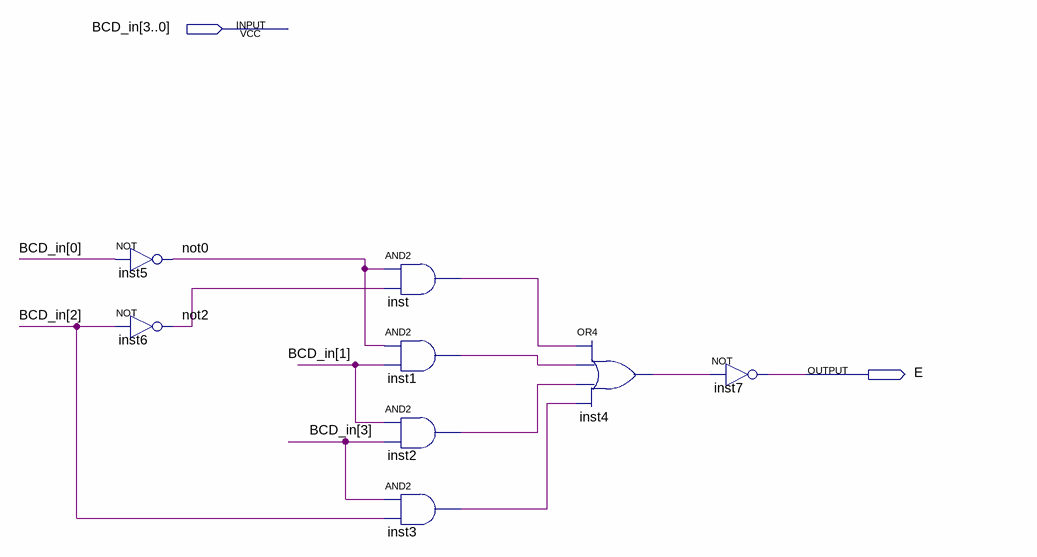
[diagram p0: schematic sheet]
// Quartus schematic E.bdf as structural Verilog: 8 symbols, 2 pins
module E (
  input  [3:0] BCD_in,
  output E
);

  wire inst1_out, inst2_out, inst3_out, inst4_out, inst_out, not0, not2;

  not inst5 (not0, BCD_in[0]);
  not inst6 (not2, BCD_in[2]);
  and inst (inst_out, not0, not2);
  and inst1 (inst1_out, not0, BCD_in[1]);
  and inst2 (inst2_out, BCD_in[1], BCD_in[3]);
  and inst3 (inst3_out, BCD_in[3], BCD_in[2]);
  or inst4 (inst4_out, inst_out, inst1_out, inst2_out, inst3_out);
  not inst7 (E, inst4_out);
endmodule
